# EAGLE design led_watch (EAGLE 5.12)

## Sheet 1 of 2
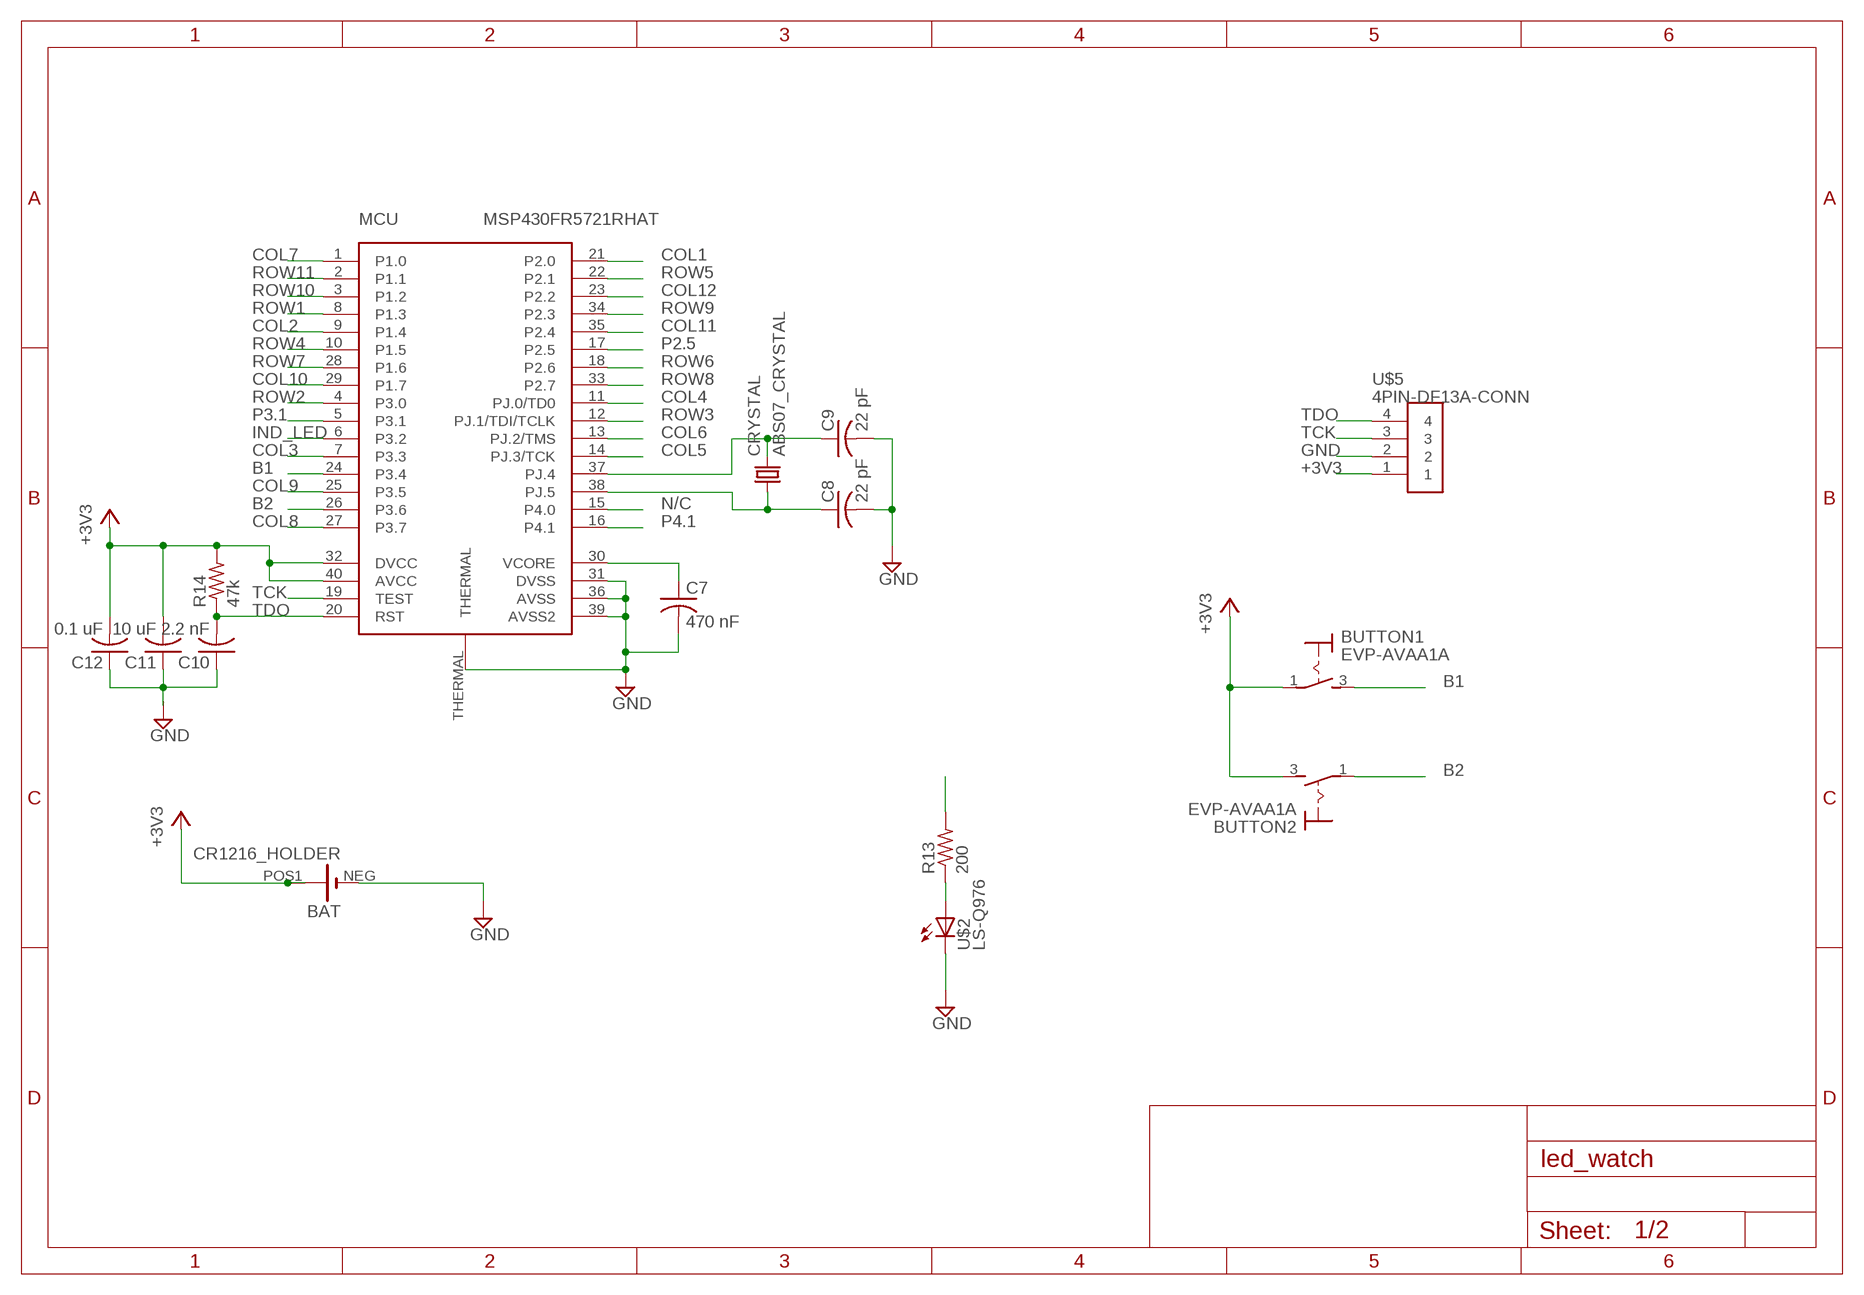
[diagram p0: schematic, sheet 1]

### Parts
BAT  CR1216_HOLDER  [CR1216]
BUTTON1  EVP-AVAA1A  [TACTILE-EVQP40B3M]
BUTTON2  EVP-AVAA1A  [TACTILE-EVQP40B3M]
C7  470 nF  C-USC0402  [C0402]
C8  22 pF  C-USC0402  [C0402]
C9  22 pF  C-USC0402  [C0402]
C10  2.2 nF  C-USC0402  [C0402]
C11  10 uF  C-USC0402  [C0402]
C12  0.1 uF  C-USC0402  [C0402]
CRYSTAL  ABS07_CRYSTAL  [ABS07]
MCU  MSP430FR5721RHAT  [40PIN-VQFN]
R13  200  R-US_R0201  [R0201]
R14  47k  R-US_R0402  [R0402]
U$2  LS-Q976  [SMD_LED_0402]
U$5  4PIN-DF13A-CONN  [4-PADS]

### Nets
+3V3: BAT.POS1(+) BAT.POS2(+) BUTTON1.1(P) BUTTON2.3(S) C11.2 C12.2 MCU.32(DVCC) MCU.40(AVCC) R14.2 U$5.1
B1: BUTTON1.3(S) MCU.24(P3.4)
B2: BUTTON2.1(P) MCU.26(P3.6)
COL1: MCU.21(P2.0) ; also sheet 2
COL2: MCU.9(P1.4) ; also sheet 2
COL3: MCU.7(P3.3) ; also sheet 2
COL4: MCU.11(PJ.0/TD0) ; also sheet 2
COL5: MCU.14(PJ.3/TCK) ; also sheet 2
COL6: MCU.13(PJ.2/TMS) ; also sheet 2
COL7: MCU.1(P1.0) ; also sheet 2
COL8: MCU.27(P3.7) ; also sheet 2
COL9: MCU.25(P3.5) ; also sheet 2
COL10: MCU.29(P1.7) ; also sheet 2
COL11: MCU.35(P2.4) ; also sheet 2
COL12: MCU.23(P2.2) ; also sheet 2
GND: BAT.NEG(-) C7.2 C8.2 C9.2 MCU.31(DVSS) MCU.36(AVSS) MCU.39(AVSS2) MCU.THERMAL U$2.2C(C) U$5.2
IND_LED: MCU.6(P3.2) R13.2
N$1: C9.1 CRYSTAL.2 MCU.37(PJ.4)
N$2: C8.1 CRYSTAL.1 MCU.38(PJ.5)
N$3: R13.1 U$2.1A(A)
N$4: C7.1 MCU.30(VCORE)
N$6: C10.1 C11.1 C12.1
N/C: MCU.15(P4.0)
P2.5: MCU.17(P2.5)
P3.1: MCU.5(P3.1)
P4.1: MCU.16(P4.1)
ROW1: MCU.8(P1.3) ; also sheet 2
ROW2: MCU.4(P3.0) ; also sheet 2
ROW3: MCU.12(PJ.1/TDI/TCLK) ; also sheet 2
ROW4: MCU.10(P1.5) ; also sheet 2
ROW5: MCU.22(P2.1) ; also sheet 2
ROW6: MCU.18(P2.6) ; also sheet 2
ROW7: MCU.28(P1.6) ; also sheet 2
ROW8: MCU.33(P2.7) ; also sheet 2
ROW9: MCU.34(P2.3) ; also sheet 2
ROW10: MCU.3(P1.2) ; also sheet 2
ROW11: MCU.2(P1.1) ; also sheet 2
TCK: MCU.19(TEST) U$5.3
TDO: C10.2 MCU.20(RST) R14.1 U$5.4

## Sheet 2 of 2
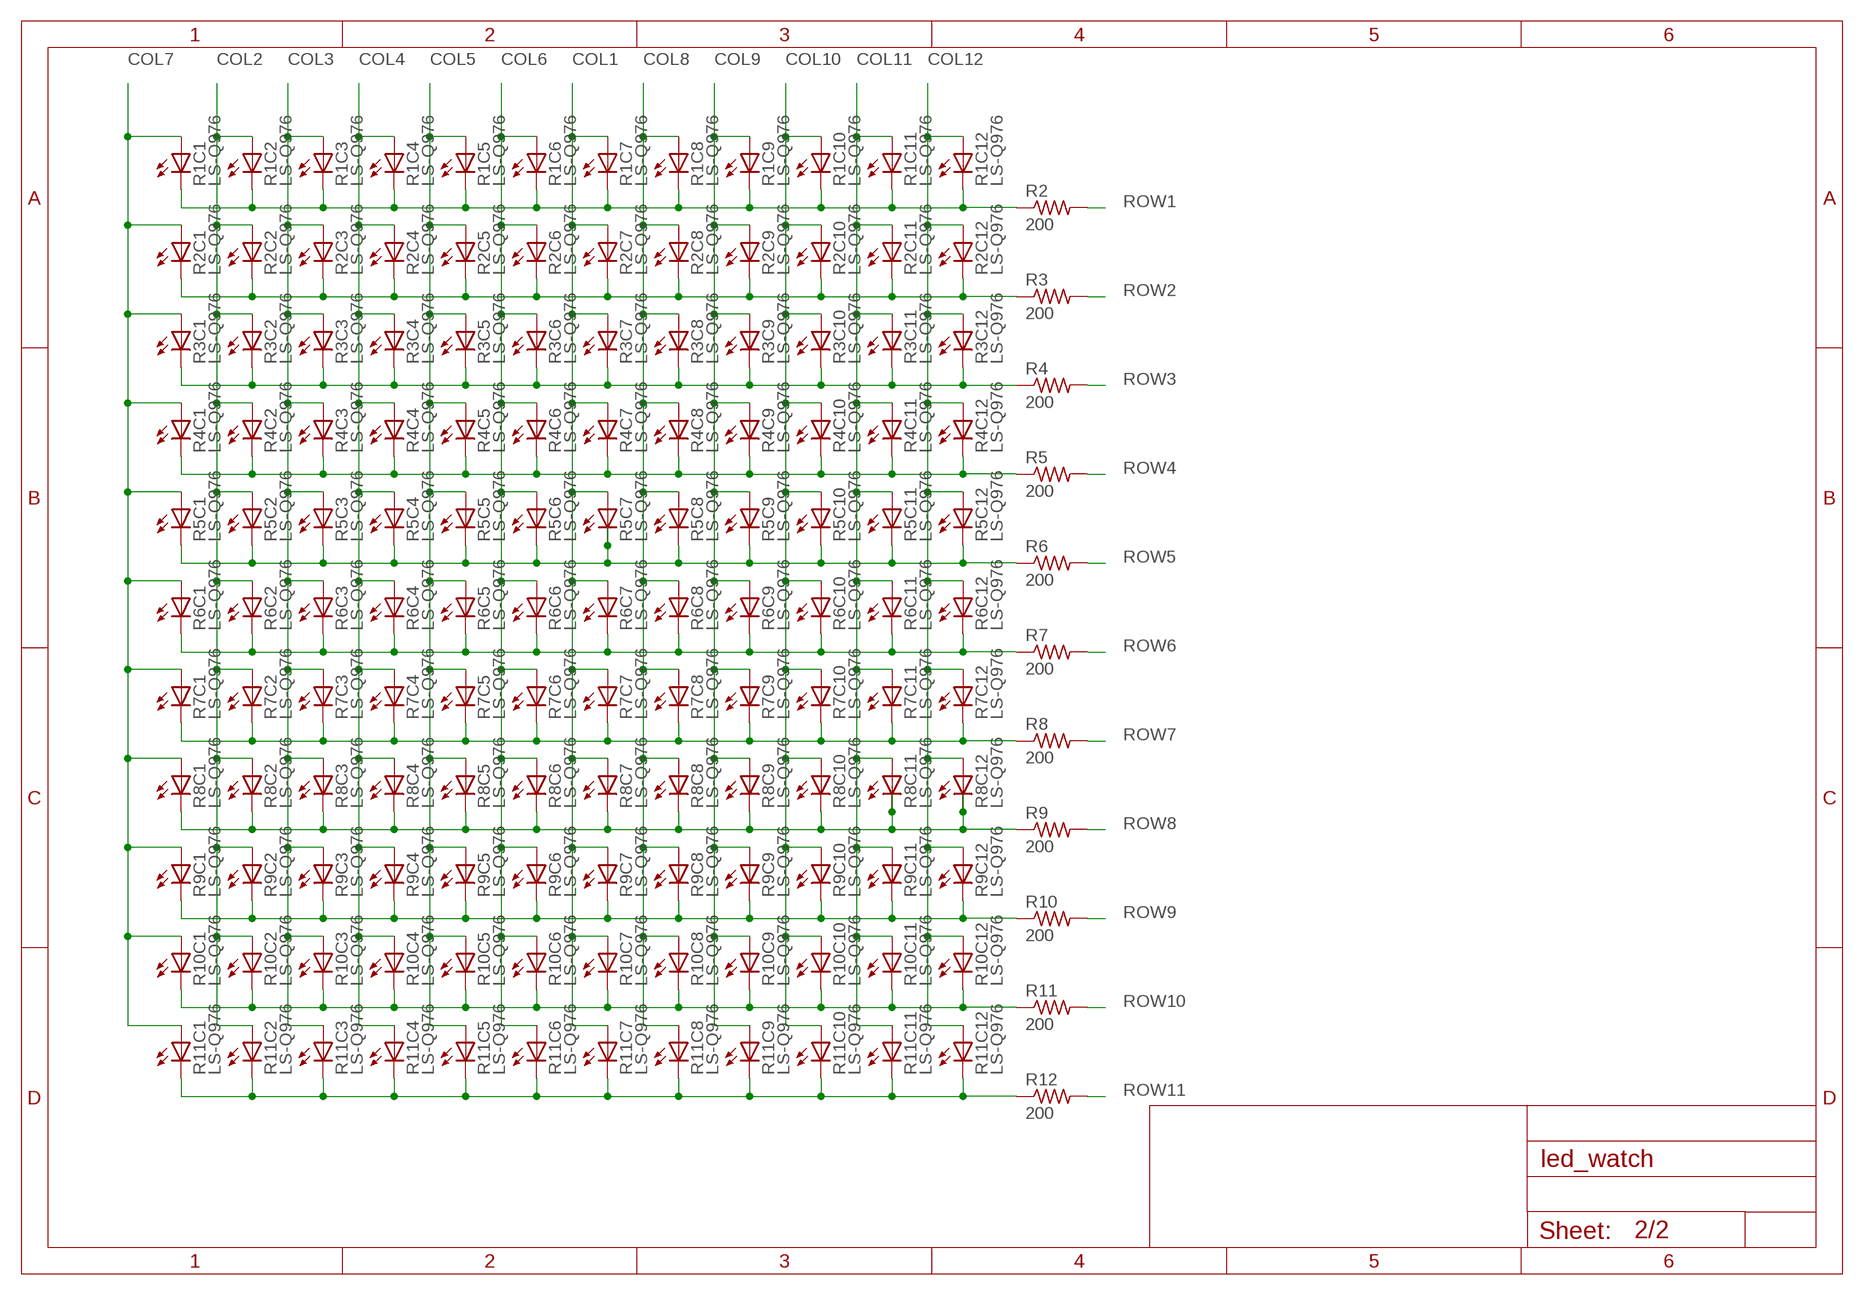
[diagram p1: schematic, sheet 2]

### Parts
R1C1  LS-Q976  [SMD_LED_0402]
R1C2  LS-Q976  [SMD_LED_0402]
R1C3  LS-Q976  [SMD_LED_0402]
R1C4  LS-Q976  [SMD_LED_0402]
R1C5  LS-Q976  [SMD_LED_0402]
R1C6  LS-Q976  [SMD_LED_0402]
R1C7  LS-Q976  [SMD_LED_0402]
R1C8  LS-Q976  [SMD_LED_0402]
R1C9  LS-Q976  [SMD_LED_0402]
R1C10  LS-Q976  [SMD_LED_0402]
R1C11  LS-Q976  [SMD_LED_0402]
R1C12  LS-Q976  [SMD_LED_0402]
R2  200  R-US_R0201  [R0201]
R2C1  LS-Q976  [SMD_LED_0402]
R2C2  LS-Q976  [SMD_LED_0402]
R2C3  LS-Q976  [SMD_LED_0402]
R2C4  LS-Q976  [SMD_LED_0402]
R2C5  LS-Q976  [SMD_LED_0402]
R2C6  LS-Q976  [SMD_LED_0402]
R2C7  LS-Q976  [SMD_LED_0402]
R2C8  LS-Q976  [SMD_LED_0402]
R2C9  LS-Q976  [SMD_LED_0402]
R2C10  LS-Q976  [SMD_LED_0402]
R2C11  LS-Q976  [SMD_LED_0402]
R2C12  LS-Q976  [SMD_LED_0402]
R3  200  R-US_R0201  [R0201]
R3C1  LS-Q976  [SMD_LED_0402]
R3C2  LS-Q976  [SMD_LED_0402]
R3C3  LS-Q976  [SMD_LED_0402]
R3C4  LS-Q976  [SMD_LED_0402]
R3C5  LS-Q976  [SMD_LED_0402]
R3C6  LS-Q976  [SMD_LED_0402]
R3C7  LS-Q976  [SMD_LED_0402]
R3C8  LS-Q976  [SMD_LED_0402]
R3C9  LS-Q976  [SMD_LED_0402]
R3C10  LS-Q976  [SMD_LED_0402]
R3C11  LS-Q976  [SMD_LED_0402]
R3C12  LS-Q976  [SMD_LED_0402]
R4  200  R-US_R0201  [R0201]
R4C1  LS-Q976  [SMD_LED_0402]
R4C2  LS-Q976  [SMD_LED_0402]
R4C3  LS-Q976  [SMD_LED_0402]
R4C4  LS-Q976  [SMD_LED_0402]
R4C5  LS-Q976  [SMD_LED_0402]
R4C6  LS-Q976  [SMD_LED_0402]
R4C7  LS-Q976  [SMD_LED_0402]
R4C8  LS-Q976  [SMD_LED_0402]
R4C9  LS-Q976  [SMD_LED_0402]
R4C10  LS-Q976  [SMD_LED_0402]
R4C11  LS-Q976  [SMD_LED_0402]
R4C12  LS-Q976  [SMD_LED_0402]
R5  200  R-US_R0201  [R0201]
R5C1  LS-Q976  [SMD_LED_0402]
R5C2  LS-Q976  [SMD_LED_0402]
R5C3  LS-Q976  [SMD_LED_0402]
R5C4  LS-Q976  [SMD_LED_0402]
R5C5  LS-Q976  [SMD_LED_0402]
R5C6  LS-Q976  [SMD_LED_0402]
R5C7  LS-Q976  [SMD_LED_0402]
R5C8  LS-Q976  [SMD_LED_0402]
R5C9  LS-Q976  [SMD_LED_0402]
R5C10  LS-Q976  [SMD_LED_0402]
R5C11  LS-Q976  [SMD_LED_0402]
R5C12  LS-Q976  [SMD_LED_0402]
R6  200  R-US_R0201  [R0201]
R6C1  LS-Q976  [SMD_LED_0402]
R6C2  LS-Q976  [SMD_LED_0402]
R6C3  LS-Q976  [SMD_LED_0402]
R6C4  LS-Q976  [SMD_LED_0402]
R6C5  LS-Q976  [SMD_LED_0402]
R6C6  LS-Q976  [SMD_LED_0402]
R6C7  LS-Q976  [SMD_LED_0402]
R6C8  LS-Q976  [SMD_LED_0402]
R6C9  LS-Q976  [SMD_LED_0402]
R6C10  LS-Q976  [SMD_LED_0402]
R6C11  LS-Q976  [SMD_LED_0402]
R6C12  LS-Q976  [SMD_LED_0402]
R7  200  R-US_R0201  [R0201]
R7C1  LS-Q976  [SMD_LED_0402]
R7C2  LS-Q976  [SMD_LED_0402]
R7C3  LS-Q976  [SMD_LED_0402]
R7C4  LS-Q976  [SMD_LED_0402]
R7C5  LS-Q976  [SMD_LED_0402]
R7C6  LS-Q976  [SMD_LED_0402]
R7C7  LS-Q976  [SMD_LED_0402]
R7C8  LS-Q976  [SMD_LED_0402]
R7C9  LS-Q976  [SMD_LED_0402]
R7C10  LS-Q976  [SMD_LED_0402]
R7C11  LS-Q976  [SMD_LED_0402]
R7C12  LS-Q976  [SMD_LED_0402]
R8  200  R-US_R0201  [R0201]
R8C1  LS-Q976  [SMD_LED_0402]
R8C2  LS-Q976  [SMD_LED_0402]
R8C3  LS-Q976  [SMD_LED_0402]
R8C4  LS-Q976  [SMD_LED_0402]
R8C5  LS-Q976  [SMD_LED_0402]
R8C6  LS-Q976  [SMD_LED_0402]
R8C7  LS-Q976  [SMD_LED_0402]
R8C8  LS-Q976  [SMD_LED_0402]
R8C9  LS-Q976  [SMD_LED_0402]
R8C10  LS-Q976  [SMD_LED_0402]
R8C11  LS-Q976  [SMD_LED_0402]
R8C12  LS-Q976  [SMD_LED_0402]
R9  200  R-US_R0201  [R0201]
R9C1  LS-Q976  [SMD_LED_0402]
R9C2  LS-Q976  [SMD_LED_0402]
R9C3  LS-Q976  [SMD_LED_0402]
R9C4  LS-Q976  [SMD_LED_0402]
R9C5  LS-Q976  [SMD_LED_0402]
R9C6  LS-Q976  [SMD_LED_0402]
R9C7  LS-Q976  [SMD_LED_0402]
R9C8  LS-Q976  [SMD_LED_0402]
R9C9  LS-Q976  [SMD_LED_0402]
R9C10  LS-Q976  [SMD_LED_0402]
R9C11  LS-Q976  [SMD_LED_0402]
R9C12  LS-Q976  [SMD_LED_0402]
R10  200  R-US_R0201  [R0201]
R10C1  LS-Q976  [SMD_LED_0402]
R10C2  LS-Q976  [SMD_LED_0402]
R10C3  LS-Q976  [SMD_LED_0402]
R10C4  LS-Q976  [SMD_LED_0402]
R10C5  LS-Q976  [SMD_LED_0402]
R10C6  LS-Q976  [SMD_LED_0402]
R10C7  LS-Q976  [SMD_LED_0402]
R10C8  LS-Q976  [SMD_LED_0402]
R10C9  LS-Q976  [SMD_LED_0402]
R10C10  LS-Q976  [SMD_LED_0402]
R10C11  LS-Q976  [SMD_LED_0402]
R10C12  LS-Q976  [SMD_LED_0402]
R11  200  R-US_R0201  [R0201]
R11C1  LS-Q976  [SMD_LED_0402]
R11C2  LS-Q976  [SMD_LED_0402]
R11C3  LS-Q976  [SMD_LED_0402]
R11C4  LS-Q976  [SMD_LED_0402]
R11C5  LS-Q976  [SMD_LED_0402]
R11C6  LS-Q976  [SMD_LED_0402]
R11C7  LS-Q976  [SMD_LED_0402]
R11C8  LS-Q976  [SMD_LED_0402]
R11C9  LS-Q976  [SMD_LED_0402]
R11C10  LS-Q976  [SMD_LED_0402]
R11C11  LS-Q976  [SMD_LED_0402]
R11C12  LS-Q976  [SMD_LED_0402]
R12  200  R-US_R0201  [R0201]

### Nets
COL1: R1C7.1A(A) R2C7.1A(A) R3C7.1A(A) R4C7.1A(A) R5C7.1A(A) R6C7.1A(A) R7C7.1A(A) R8C7.1A(A) R9C7.1A(A) R10C7.1A(A) R11C7.1A(A) ; also sheet 1
COL2: R1C2.1A(A) R2C2.1A(A) R3C2.1A(A) R4C2.1A(A) R5C2.1A(A) R6C2.1A(A) R7C2.1A(A) R8C2.1A(A) R9C2.1A(A) R10C2.1A(A) R11C2.1A(A) ; also sheet 1
COL3: R1C3.1A(A) R2C3.1A(A) R3C3.1A(A) R4C3.1A(A) R5C3.1A(A) R6C3.1A(A) R7C3.1A(A) R8C3.1A(A) R9C3.1A(A) R10C3.1A(A) R11C3.1A(A) ; also sheet 1
COL4: R1C4.1A(A) R2C4.1A(A) R3C4.1A(A) R4C4.1A(A) R5C4.1A(A) R6C4.1A(A) R7C4.1A(A) R8C4.1A(A) R9C4.1A(A) R10C4.1A(A) R11C4.1A(A) ; also sheet 1
COL5: R1C5.1A(A) R2C5.1A(A) R3C5.1A(A) R4C5.1A(A) R5C5.1A(A) R6C5.1A(A) R7C5.1A(A) R8C5.1A(A) R9C5.1A(A) R10C5.1A(A) R11C5.1A(A) ; also sheet 1
COL6: R1C6.1A(A) R2C6.1A(A) R3C6.1A(A) R4C6.1A(A) R5C6.1A(A) R6C6.1A(A) R7C6.1A(A) R8C6.1A(A) R9C6.1A(A) R10C6.1A(A) R11C6.1A(A) ; also sheet 1
COL7: R1C1.1A(A) R2C1.1A(A) R3C1.1A(A) R4C1.1A(A) R5C1.1A(A) R6C1.1A(A) R7C1.1A(A) R8C1.1A(A) R9C1.1A(A) R10C1.1A(A) R11C1.1A(A) ; also sheet 1
COL8: R1C8.1A(A) R2C8.1A(A) R3C8.1A(A) R4C8.1A(A) R5C8.1A(A) R6C8.1A(A) R7C8.1A(A) R8C8.1A(A) R9C8.1A(A) R10C8.1A(A) R11C8.1A(A) ; also sheet 1
COL9: R1C9.1A(A) R2C9.1A(A) R3C9.1A(A) R4C9.1A(A) R5C9.1A(A) R6C9.1A(A) R7C9.1A(A) R8C9.1A(A) R9C9.1A(A) R10C9.1A(A) R11C9.1A(A) ; also sheet 1
COL10: R1C10.1A(A) R2C10.1A(A) R3C10.1A(A) R4C10.1A(A) R5C10.1A(A) R6C10.1A(A) R7C10.1A(A) R8C10.1A(A) R9C10.1A(A) R10C10.1A(A) R11C10.1A(A) ; also sheet 1
COL11: R1C11.1A(A) R2C11.1A(A) R3C11.1A(A) R4C11.1A(A) R5C11.1A(A) R6C11.1A(A) R7C11.1A(A) R8C11.1A(A) R9C11.1A(A) R10C11.1A(A) R11C11.1A(A) ; also sheet 1
COL12: R1C12.1A(A) R2C12.1A(A) R3C12.1A(A) R4C12.1A(A) R5C12.1A(A) R6C12.1A(A) R7C12.1A(A) R8C12.1A(A) R9C12.1A(A) R10C12.1A(A) R11C12.1A(A) ; also sheet 1
R2: R1C1.2C(C) R1C2.2C(C) R1C3.2C(C) R1C4.2C(C) R1C5.2C(C) R1C6.2C(C) R1C7.2C(C) R1C8.2C(C) R1C9.2C(C) R1C10.2C(C) R1C11.2C(C) R1C12.2C(C) R2.1
R3: R2C1.2C(C) R2C2.2C(C) R2C3.2C(C) R2C4.2C(C) R2C5.2C(C) R2C6.2C(C) R2C7.2C(C) R2C8.2C(C) R2C9.2C(C) R2C10.2C(C) R2C11.2C(C) R2C12.2C(C) R3.1
R4: R3C1.2C(C) R3C2.2C(C) R3C3.2C(C) R3C4.2C(C) R3C5.2C(C) R3C6.2C(C) R3C7.2C(C) R3C8.2C(C) R3C9.2C(C) R3C10.2C(C) R3C11.2C(C) R3C12.2C(C) R4.1
R5: R4C1.2C(C) R4C2.2C(C) R4C3.2C(C) R4C4.2C(C) R4C5.2C(C) R4C6.2C(C) R4C7.2C(C) R4C8.2C(C) R4C9.2C(C) R4C10.2C(C) R4C11.2C(C) R4C12.2C(C) R5.1
R6: R5C1.2C(C) R5C2.2C(C) R5C3.2C(C) R5C4.2C(C) R5C5.2C(C) R5C6.2C(C) R5C7.2C(C) R5C8.2C(C) R5C9.2C(C) R5C10.2C(C) R5C11.2C(C) R5C12.2C(C) R6.1
R7: R6C1.2C(C) R6C2.2C(C) R6C3.2C(C) R6C4.2C(C) R6C5.2C(C) R6C6.2C(C) R6C7.2C(C) R6C8.2C(C) R6C9.2C(C) R6C10.2C(C) R6C11.2C(C) R6C12.2C(C) R7.1
R8: R7C1.2C(C) R7C2.2C(C) R7C3.2C(C) R7C4.2C(C) R7C5.2C(C) R7C6.2C(C) R7C7.2C(C) R7C8.2C(C) R7C9.2C(C) R7C10.2C(C) R7C11.2C(C) R7C12.2C(C) R8.1
R9: R8C1.2C(C) R8C2.2C(C) R8C3.2C(C) R8C4.2C(C) R8C5.2C(C) R8C6.2C(C) R8C7.2C(C) R8C8.2C(C) R8C9.2C(C) R8C10.2C(C) R8C11.2C(C) R8C12.2C(C) R9.1
R10: R9C1.2C(C) R9C2.2C(C) R9C3.2C(C) R9C4.2C(C) R9C5.2C(C) R9C6.2C(C) R9C7.2C(C) R9C8.2C(C) R9C9.2C(C) R9C10.2C(C) R9C11.2C(C) R9C12.2C(C) R10.1
R11: R10C1.2C(C) R10C2.2C(C) R10C3.2C(C) R10C4.2C(C) R10C5.2C(C) R10C6.2C(C) R10C7.2C(C) R10C8.2C(C) R10C9.2C(C) R10C10.2C(C) R10C11.2C(C) R10C12.2C(C) R11.1
R12: R11C1.2C(C) R11C2.2C(C) R11C3.2C(C) R11C4.2C(C) R11C5.2C(C) R11C6.2C(C) R11C7.2C(C) R11C8.2C(C) R11C9.2C(C) R11C10.2C(C) R11C11.2C(C) R11C12.2C(C) R12.1
ROW1: R2.2 ; also sheet 1
ROW2: R3.2 ; also sheet 1
ROW3: R4.2 ; also sheet 1
ROW4: R5.2 ; also sheet 1
ROW5: R6.2 ; also sheet 1
ROW6: R7.2 ; also sheet 1
ROW7: R8.2 ; also sheet 1
ROW8: R9.2 ; also sheet 1
ROW9: R10.2 ; also sheet 1
ROW10: R11.2 ; also sheet 1
ROW11: R12.2 ; also sheet 1

## Library data of the parts
BAT = personal:CR1216_HOLDER
BUTTON1 BUTTON2 = personal:EVP-AVAA1A
C7-C12 = rcl:C-US: CAPACITOR, American symbol
CRYSTAL = personal:ABS07_CRYSTAL
MCU = personal:MSP430FR5721RHAT
R1C1-R1C12 R2C1-R2C12 R3C1-R3C12 R4C1-R4C12 R5C1-R5C12 R6C1-R6C12 R7C1-R7C12 R8C1-R8C12 R9C1-R9C12 R10C1-R10C12 R11C1-R11C12 U$2 = personal:LS-Q976
R2-R14 = rcl:R-US_: RESISTOR, American symbol
U$5 = personal:4PIN-DF13A-CONN

## Net classes
0 default: drill 0.33 mm

## Board
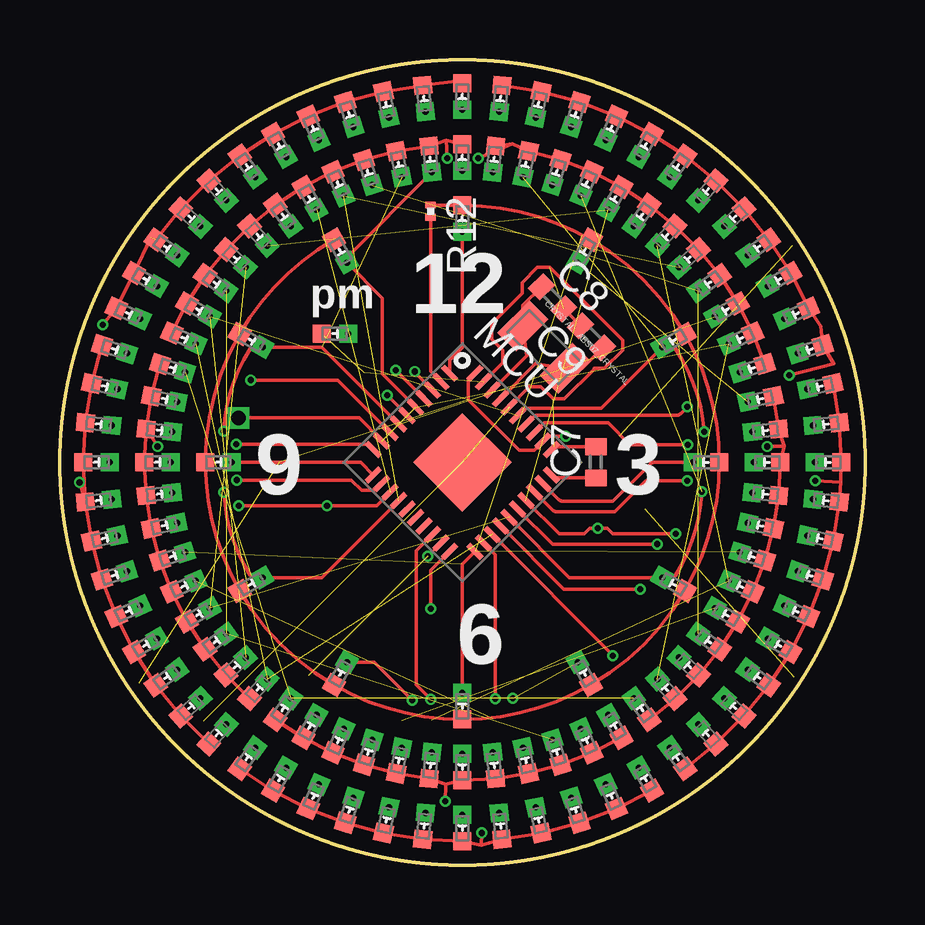
[diagram p2: board, top side]
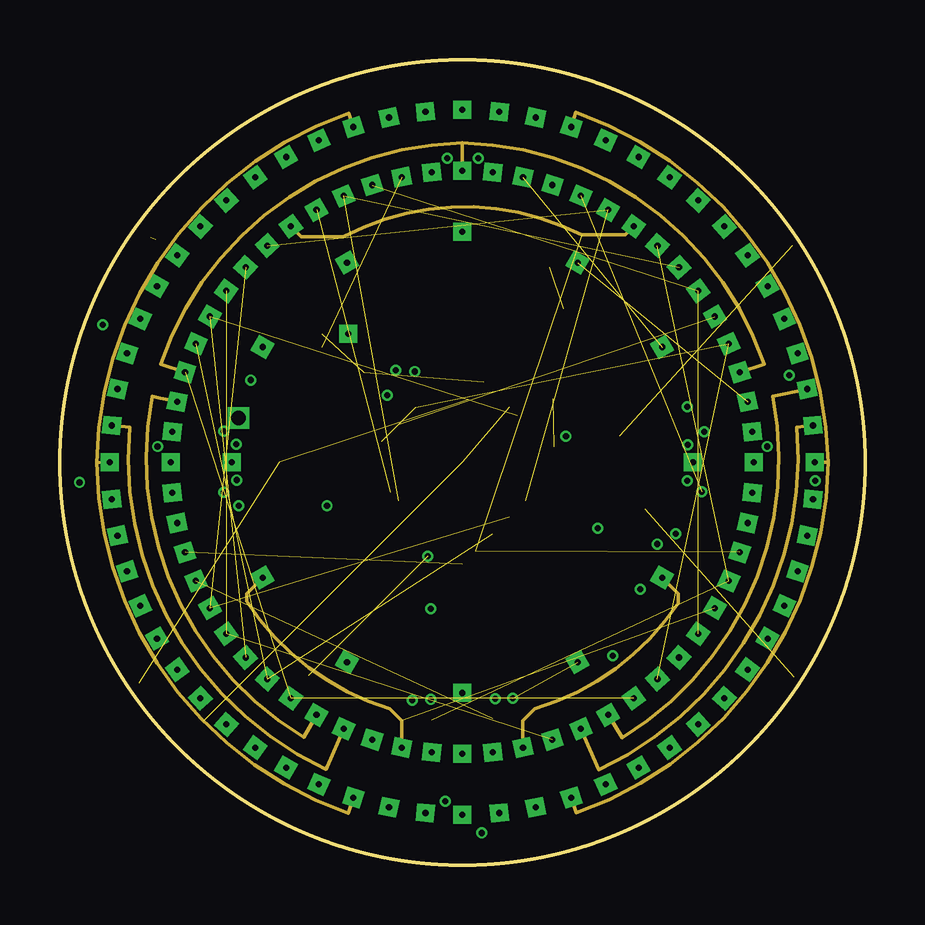
[diagram p3: board, inner layer Route3]
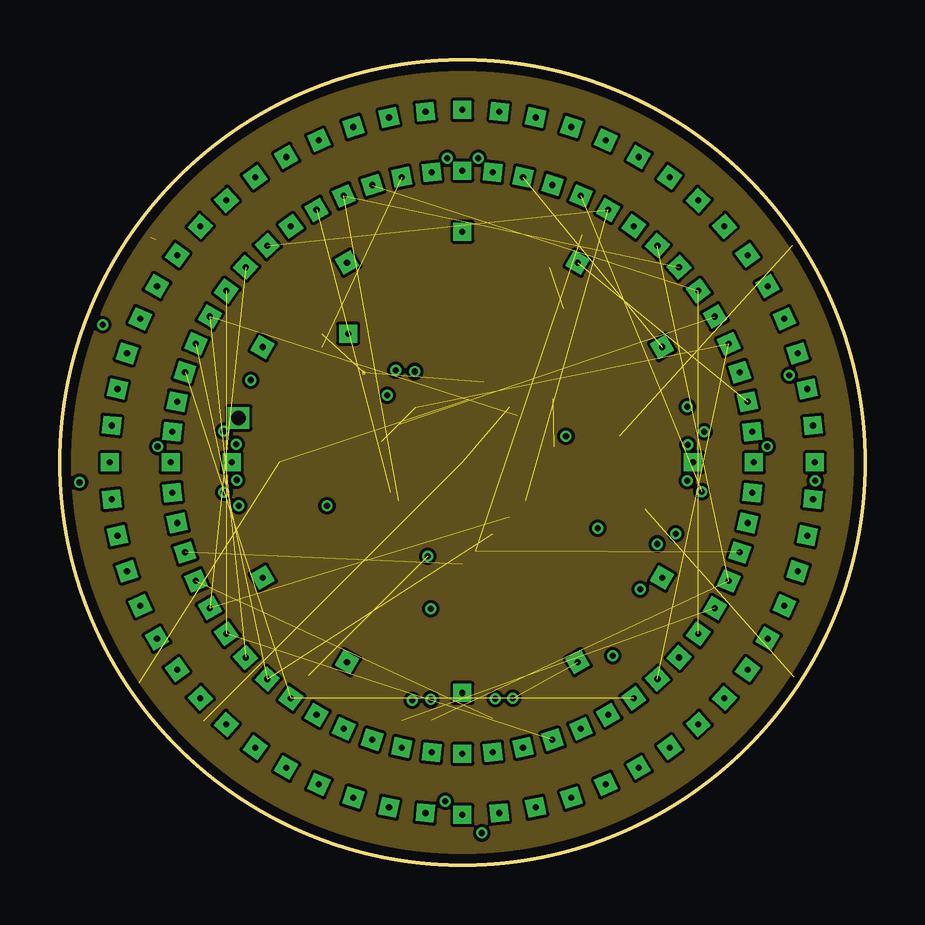
[diagram p4: board, inner layer Route15]
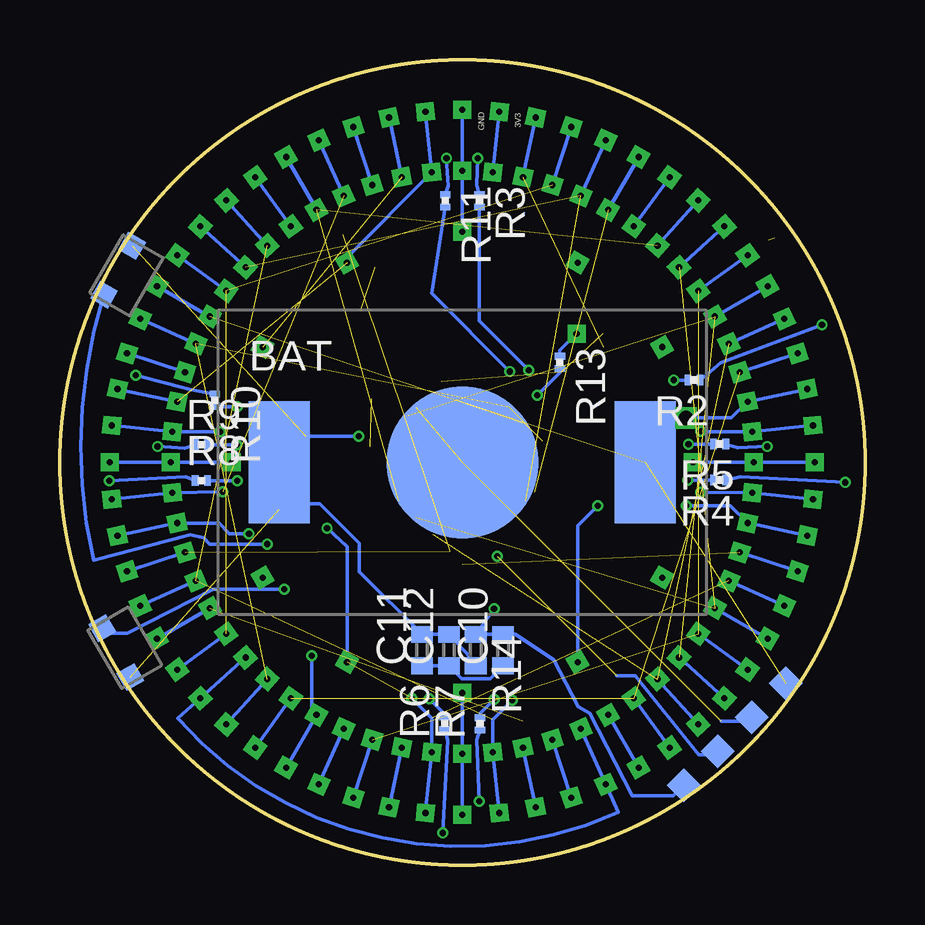
[diagram p5: board, bottom side, seen from below]

Size 33.53 x 33.53 mm. Coordinates in mm from the lower left corner, seen from the top.
Outline: circle at 16.76,16.76 radius 16.76
Copper layers (1+3*15+16): Top 0.0356mm / dielectric 0.1702mm / Route3 0.035mm / dielectric 0.2mm / Route15 0.0178mm / dielectric 0.1981mm / Bottom 0.0356mm
Design rules "OSH Park 4-layer 5-5 *": minimum track width 5mil, minimum drill 10mil, track to track 5mil, track to pad 5mil, pad to pad 5mil, via to via 5mil, smd to smd 5mil, copper to edge 15mil, drill to drill 8mil, minimum pad ring 4mil, minimum via ring 4mil, stop-mask expansion 4mil, vias tented up to drill 20mil, thermal gap 10mil

### Footprints (pad centres in the part's own frame; a part is rotated, then mirrored left to right if it is on the bottom)
CR1216 = smd 6.35 x 6.35: NEG 0,0 | smd 2.54 x 5.08: POS1 -7.62,0; POS2 7.62,0
TACTILE-EVQP40B3M = smd 0.85 x 0.85: 1 -1.175,1.986; 3 1.175,1.986
C0402 = smd 0.7 x 0.9: 1 -0.65,0; 2 0.65,0
ABS07 = smd 1.092 x 1.905: 1 -1.245,0; 2 1.245,0
40PIN-VQFN = smd 0.8 x 0.23: 1 -3,2.25; 2 -3,1.75; 3 -3,1.25; 4 -3,0.75; 5 -3,0.25; 6 -3,-0.25; 7 -3,-0.75; 8 -3,-1.25; 9 -3,-1.75; 10 -3,-2.25; 21 3,-2.25; 22 3,-1.75; 23 3,-1.25; 24 3,-0.75; 25 3,-0.25; 26 3,0.25; 27 3,0.75; 28 3,1.25; 29 3,1.75; 30 3,2.25 | smd 0.23 x 0.8: 11 -2.25,-3; 12 -1.75,-3; 13 -1.25,-3; 14 -0.75,-3; 15 -0.25,-3; 16 0.25,-3; 17 0.75,-3; 18 1.25,-3; 19 1.75,-3; 20 2.25,-3; 31 2.25,3; 32 1.75,3; 33 1.25,3; 34 0.75,3; 35 0.25,3; 36 -0.25,3; 37 -0.75,3; 38 -1.25,3; 39 -1.75,3; 40 -2.25,3 | smd 2.9 x 2.9: THERMAL 0,0
SMD_LED_0402 = drill 0.254 pad 0.75 square: 1A 0.55,0 | smd 0.75 x 0.75: 2C -0.55,0
R0201 = smd 0.28 x 0.43: 1 -0.255,0; 2 0.255,0
R0402 = smd 0.7 x 0.9: 1 -0.65,0; 2 0.65,0
4-PADS = smd 1 x 1: 1 3,0; 2 1,0; 3 -1,0; 4 -3,0

### Placement (x,y rotation side)
BAT  16.76,16.76 0 bottom
BUTTON1  29.46,9.83 120 bottom
BUTTON2  29.39,23.77 60 bottom
C7  22.33,16.76 90 top
C8  20.52,23.62 315 top
C9  22.15,22 135 top
C10  15.06,8.94 90 bottom
C11  18.44,8.94 90 bottom
C12  17.32,8.94 90 bottom
CRYSTAL  20.17,21.56 315 top
MCU  16.76,16.76 315 top
R1C1  16.76,32 270 top
R1C2  15.17,31.92 276 top
R1C3  13.6,31.67 282 top
R1C4  12.05,31.26 288 top
R1C5  10.57,30.69 294 top
R1C6  9.14,29.96 300 top
R1C7  7.81,29.09 306 top
R1C8  6.57,28.09 312 top
R1C9  5.44,26.96 318 top
R1C10  4.43,25.72 324 top
R1C11  3.57,24.38 330 top
R1C12  2.84,22.96 336 top
R2  7.11,20.19 180 bottom
R2C1  16.76,29.46 270 top
R2C2  15.44,29.39 276 top
R2C3  14.12,29.19 282 top
R2C4  12.84,28.84 288 top
R2C5  11.6,28.37 294 top
R2C6  10.41,27.76 300 top
R2C7  9.3,27.04 306 top
R2C8  8.27,26.2 312 top
R2C9  7.33,25.26 318 top
R2C10  6.49,24.23 324 top
R2C11  5.77,23.11 330 top
R2C12  5.16,21.93 336 top
R3  16.05,27.66 270 bottom
R3C1  2.27,21.47 342 top
R3C2  1.86,19.93 348 top
R3C3  1.61,18.36 354 top
R3C4  1.52,16.76 0 top
R3C5  1.61,15.17 6 top
R3C6  1.86,13.6 12 top
R3C7  2.27,12.05 18 top
R3C8  2.84,10.57 24 top
R3C9  3.57,9.14 30 top
R3C10  4.43,7.81 36 top
R3C11  5.44,6.57 42 top
R3C12  6.57,5.44 48 top
R4  6.05,16.03 180 bottom
R4C1  4.69,20.69 342 top
R4C2  4.34,19.4 348 top
R4C3  4.13,18.09 354 top
R4C4  4.06,16.76 0 top
R4C5  4.13,15.44 6 top
R4C6  4.34,14.12 12 top
R4C7  4.69,12.84 18 top
R4C8  5.16,11.6 24 top
R4C9  5.77,10.41 30 top
R4C10  6.49,9.3 36 top
R4C11  7.33,8.27 42 top
R4C12  8.27,7.33 48 top
R5  6.05,17.53 180 bottom
R5C1  7.81,4.43 54 top
R5C2  9.14,3.57 60 top
R5C3  10.57,2.84 66 top
R5C4  12.05,2.27 72 top
R5C5  13.6,1.86 78 top
R5C6  15.17,1.61 84 top
R5C7  16.76,1.52 90 top
R5C8  18.36,1.61 96 top
R5C9  19.93,1.86 102 top
R5C10  21.47,2.27 108 top
R5C11  22.96,2.84 114 top
R5C12  24.38,3.57 120 top
R6  17.5,5.89 90 bottom
R6C1  9.3,6.49 54 top
R6C2  10.41,5.77 60 top
R6C3  11.6,5.16 66 top
R6C4  12.84,4.69 72 top
R6C5  14.12,4.34 78 top
R6C6  15.44,4.13 84 top
R6C7  16.76,4.06 90 top
R6C8  18.09,4.13 96 top
R6C9  19.4,4.34 102 top
R6C10  20.69,4.69 108 top
R6C11  21.93,5.16 114 top
R6C12  23.11,5.77 120 top
R7  16.03,5.87 90 bottom
R7C1  25.72,4.43 126 top
R7C2  26.96,5.44 132 top
R7C3  28.09,6.57 138 top
R7C4  29.09,7.81 144 top
R7C5  29.96,9.14 150 top
R7C6  30.69,10.57 156 top
R7C7  31.26,12.05 162 top
R7C8  31.67,13.6 168 top
R7C9  31.92,15.17 174 top
R7C10  32,16.76 180 top
R7C11  31.92,18.36 186 top
R7C12  31.67,19.93 192 top
R8  27.64,16 0 bottom
R8C1  24.23,6.49 126 top
R8C2  25.26,7.33 132 top
R8C3  26.2,8.27 138 top
R8C4  27.04,9.3 144 top
R8C5  27.76,10.41 150 top
R8C6  28.37,11.6 156 top
R8C7  28.84,12.84 162 top
R8C8  29.19,14.12 168 top
R8C9  29.39,15.44 174 top
R8C10  29.46,16.76 180 top
R8C11  29.39,18.09 186 top
R8C12  29.19,19.4 192 top
R9  27.64,17.5 0 bottom
R9C1  31.26,21.47 198 top
R9C2  30.69,22.96 204 top
R9C3  29.96,24.38 210 top
R9C4  29.09,25.72 216 top
R9C5  28.09,26.96 222 top
R9C6  26.96,28.09 228 top
R9C7  25.72,29.09 234 top
R9C8  24.38,29.96 240 top
R9C9  22.96,30.69 246 top
R9C10  21.47,31.26 252 top
R9C11  19.93,31.67 258 top
R9C12  18.36,31.92 264 top
R10  27.08,19.35 270 bottom
R10C1  28.84,20.69 198 top
R10C2  28.37,21.93 204 top
R10C3  27.76,23.11 210 top
R10C4  27.04,24.23 216 top
R10C5  26.2,25.26 222 top
R10C6  25.26,26.2 228 top
R10C7  24.23,27.04 234 top
R10C8  23.11,27.76 240 top
R10C9  21.93,28.37 246 top
R10C10  20.69,28.84 252 top
R10C11  19.4,29.19 258 top
R10C12  18.09,29.39 264 top
R11  17.48,27.66 270 bottom
R11C1  16.76,26.92 270 top
R11C2  11.68,25.56 300 top
R11C3  7.97,21.84 330 top
R11C4  6.6,16.76 0 top
R11C5  7.97,11.68 30 top
R11C6  11.68,7.97 60 top
R11C7  16.76,6.6 90 top
R11C8  21.84,7.97 120 top
R11C9  25.56,11.68 150 top
R11C10  26.92,16.76 180 top
R11C11  25.56,21.84 210 top
R11C12  21.84,25.56 240 top
R12  15.44,27.23 270 top
R13  12.7,20.93 270 bottom
R14  16.21,8.94 270 bottom
U$2  11.46,22.12 0 top
U$5  5.41,5.44 45 bottom

### Tracks (layer width: path | path; a pad name or v marks a point on that pad's centre or on a via)
+3V3  (via drill 0.25)  (4 unrouted)
  Top 0.152: v21.08,17.86 20.33,17.86 MCU.32 19.76,17.27 19.13,17.27 17.02,19.38 17.02,20.2 MCU.40
  Bottom 0.152: v21.08,17.86 23.29,17.86 BAT.POS1 24.38,15.04 | 24.38,15.04 24.38,14.82 | R14.2 16.1,8.29 C12.2 C11.2 21.06,12.21 21.06,13.39 22.71,15.04 24.38,15.04
B1  (via drill 0.25)
  Top 0.152: MCU.24 20.99,11.48 v24.18,11.48
  Bottom 0.152: v24.18,11.48 27.15,11.48 30.73,9.65 31.57,9.65 arc90 BUTTON1.3
B2  (via drill 0.25)
  Top 0.152: MCU.26 20.52,13.36 v24.89,13.36
  Bottom 0.152: v24.89,13.36 27.28,13.36 27.53,13.61 28.09,13.74 32.13,12.67 arc30 BUTTON2.1
COL1  (3 unrouted)
  Top 0.152: R11C7.1A 16.76,12.52 MCU.21
  Route3 0.152: R10C7.1A 23.55,26.24 21.74,26.24 arc55 11.81,26.16 10.05,26.16 R2C7.1A
  Bottom 0.152: R4C7.1A R3C7.1A | R1C7.1A R2C7.1A | R10C7.1A R9C7.1A | R8C7.1A R7C7.1A | R5C7.1A R6C7.1A R11C7.1A
COL2  (via drill 0.6)  (3 unrouted)
  Top 0.152: 14.82,19.06 13.44,20.45 13.44,23.61 R11C2.1A 11.96,25.31 R2C2.1A | v7.44,18.62 12.47,18.62 12.75,18.34 MCU.9
  Route3 0.152: R6C2.1A 10.16,5.31 arc-70 3.84,19.51 arc1 R4C2.1A
  Bottom 0.152: R6C2.1A R5C2.1A | R3C2.1A R4C2.1A 5.55,18.62 v7.44,18.62 | R2C2.1A R1C2.1A | R8C2.1A R7C2.1A | R10C2.1A R9C2.1A
COL3  (via drill 0.25)  (2 unrouted)
  Top 0.152: v6.83,18.06 arc-31 7.92,21.49 R11C3.1A 10.9,21.57 MCU.7
  Route3 0.152: R6C3.1A 11.12,4.09 11.07,3.97 arc-70 2.9,18.22 R3C3.1A
  Bottom 0.152: R3C3.1A R4C3.1A 6.81,18.03 v6.83,18.06 | R10C3.1A R9C3.1A | R8C3.1A R7C3.1A 28.63,6.1 arc-73 10.26,2.18 R5C3.1A R6C3.1A | R1C3.1A R2C3.1A
COL4  (2 unrouted)
  Top 0.152: R11C4.1A 12.52,16.76 MCU.11
  Route3 0.152: 1.52,16.74 arc-70 12.04,31.32 R1C4.1A | 1.52,16.74 arc70 12.01,2.13 R5C4.1A | R3C4.1A 1.52,16.74
  Bottom 0.152: R3C4.1A R4C4.1A R11C4.1A | R1C4.1A R2C4.1A | R10C4.1A R9C4.1A | R7C4.1A R8C4.1A | R5C4.1A R6C4.1A
COL5  (via drill 0.25)  (3 unrouted)
  Top 0.152: v6.83,15.52 arc30 7.92,12.06 R11C5.1A 10.9,11.96 MCU.14
  Route3 0.152: R6C5.1A 14.24,6.01 13.74,6.5 arc-40 7.77,10.97 7.77,11.29 R11C5.1A
  Bottom 0.152: v6.83,15.51 v6.83,15.52 R4C5.1A R3C5.1A | R1C5.1A R2C5.1A | R10C5.1A R9C5.1A | R8C5.1A R7C5.1A | R6C5.1A R5C5.1A
COL6  (via drill 0.25)  (3 unrouted)
  Top 0.152: v7.44,14.96 v11.12,14.96 13.19,14.96 MCU.13 | R11C6.1A 13.1,8.44 v14.68,6.86
  Bottom 0.152: R3C6.1A R4C6.1A 5.6,14.96 v7.44,14.96 | R2C6.1A R1C6.1A | R10C6.1A R9C6.1A | R7C6.1A R8C6.1A | R5C6.1A R6C6.1A 15.49,6.04 v14.68,6.86 | R11C6.1A 11.96,14.13 v11.12,14.96
COL7  (2 unrouted)
  Top 0.152: R11C1.1A 16.76,21.54 16.23,21.01 MCU.1
  Route3 0.152: R4C1.1A 4.19,20.85 arc-70 16.76,30.07 | R2C1.1A 16.76,30.07 | R10C1.1A 29.34,20.85 arc70 16.76,30.07
  Bottom 0.152: R6C1.1A R5C1.1A | R4C1.1A R3C1.1A | R1C1.1A R2C1.1A R11C1.1A | R10C1.1A R9C1.1A | R8C1.1A R7C1.1A
COL8  (via drill 0.25)  (4 unrouted)
  Top 0.152: MCU.27 20.8,13.79 21.84,13.79 22.07,14.02 v22.4,14.02 22.81,14.02 23.04,13.79 v25.65,13.79
  Bottom 0.152: R4C8.1A R3C8.1A | R2C8.1A R1C8.1A | R10C8.1A R9C8.1A | R7C8.1A R8C8.1A 26.9,14.22 26.47,13.79 v25.65,13.79 | R5C8.1A R6C8.1A 18.03,6.1 v18.87,6.93 | R11C8.1A 21.57,13.24 v22.4,14.02
COL9  (via drill 0.25)  (3 unrouted)
  Top 0.152: v26.75,15.54 arc-30 25.63,12.04 R11C9.1A 21.22,11.96 MCU.25
  Route3 0.152: R6C9.1A 19.29,6.01 19.79,6.5 arc40 25.76,10.9 25.76,11.29 R11C9.1A
  Bottom 0.152: R4C9.1A R3C9.1A | R2C9.1A R1C9.1A | R10C9.1A R9C9.1A | R7C9.1A R8C9.1A v26.75,15.54 | R6C9.1A R5C9.1A
COL10  (2 unrouted)
  Top 0.152: MCU.29 20.79,15.21 arc45 20.97,15.14 23.04,15.14 24.59,16.69 arc-45 24.77,16.76 R11C10.1A
  Route3 0.152: 32,16.76 arc-70 21.51,2.16 R5C10.1A | 32,16.76 arc70 21.49,31.34 R9C10.1A | R7C10.1A 32,16.76
  Bottom 0.152: R4C10.1A R3C10.1A | R1C10.1A R2C10.1A | R9C10.1A R10C10.1A | R7C10.1A R8C10.1A R11C10.1A | R5C10.1A R6C10.1A
COL11  (via drill 0.25)  (3 unrouted)
  Top 0.152: MCU.35 19.38,19.02 22.54,19.02 R11C11.1A 25.63,21.51 arc-30 v26.85,18.03
  Route3 0.152: R6C11.1A 22.45,3.96 arc70 30.71,18.23 R7C11.1A
  Bottom 0.152: R4C11.1A R3C11.1A | R2C11.1A R1C11.1A | R10C11.1A R9C11.1A | R7C11.1A R8C11.1A v26.85,18.03 | R6C11.1A R5C11.1A
COL12  (via drill 0.25)  (3 unrouted)
  Top 0.152: MCU.23 v23.04,8.72 v23.04,8.71
  Route3 0.152: R7C12.1A 29.69,19.52 arc-70 23.42,5.28 R6C12.1A
  Bottom 0.152: R4C12.1A R3C12.1A | R1C12.1A R2C12.1A | R9C12.1A R10C12.1A 21.57,25.31 R11C12.1A | R7C12.1A R8C12.1A | R5C12.1A R6C12.1A 23.04,6.44 v23.04,8.71
GND  (7 unrouted)
  Top 0.152: C8.2 C9.2 | MCU.36 19.56,19.91 20.04,19.91 20.55,19.41 21.01,19.41 22.25,20.65 22.25,20.68 22.68,20.68 23.44,21.44 23.44,21.84 20.4,24.89 19.89,24.89 19.25,24.26 19.25,23.8 17.98,22.53 17.98,21.89 18.44,21.44 18.44,20.91 MCU.39 | C7.2 20.6,17.41 MCU.31
  Route15 0.152: 12.65,20.52 12.65,20.47
  Bottom 0.152: U$5.2 4.88,5.97 5.97,5.97
  pour Route15: -5.05,36.27 38.05,36.27 38.05,-4.5 -5.05,-4.5
IND_LED  (via drill 0.25)
  Top 0.152: MCU.6 14.47,18.73 v13.64,19.56
  Bottom 0.152: v13.64,19.56 12.7,20.5 R13.2
N$1
  Top 0.152: MCU.37 19.8,20.86 CRYSTAL.2 21.76,20.68 C9.1
N$2
  Top 0.152: MCU.38 19.44,21.21 CRYSTAL.1 19.29,23.31 C8.1
N$3
  Bottom 0.152: R13.1 12.7,21.43 U$2.1A
N$4
  Top 0.152: C7.1 20.6,16.11 MCU.30
N$6
  Bottom 0.152: C11.1 C12.1 16.78,7.75 15.61,7.75 C10.1
R2  (via drill 0.25)  (1 unrouted)
  Top 0.152: R1C2.2C 16.68,32.67 | 14.83,32.41 R1C3.2C R1C4.2C R1C5.2C R1C6.2C R1C7.2C R1C8.2C R1C9.2C R1C10.2C | 3.78,26.12 R1C11.2C R1C12.2C v1.78,22.5
  Top 0.254: 16.68,32.67 R1C1.2C | 14.83,32.41 R1C2.2C
  Bottom 0.152: R2.1 5.99,20.9 v1.78,22.5
R3  (via drill 0.25)
  Top 0.152: R2C12.2C R2C11.2C R2C10.2C R2C9.2C R2C8.2C R2C7.2C R2C6.2C R2C5.2C R2C4.2C R2C3.2C R2C2.2C 16.09,30.18 | 16.09,30.18 R2C1.2C | 16.09,30.18 v16.13,29.44
  Bottom 0.152: R3.1 16.15,28.32 v16.13,29.44
R4  (via drill 0.25)
  Top 0.152: R3C5.2C R3C4.2C R3C3.2C R3C2.2C R3C1.2C | R3C12.2C R3C11.2C R3C10.2C R3C9.2C R3C8.2C R3C7.2C R3C6.2C R3C5.2C | v0.81,15.93 R3C5.2C
  Bottom 0.152: v0.81,15.93 5.18,16.15 R4.1
R5  (via drill 0.25)
  Top 0.152: R4C12.2C R4C11.2C R4C10.2C R4C9.2C R4C8.2C R4C7.2C R4C6.2C R4C5.2C R4C4.2C R4C3.2C | R4C1.2C R4C2.2C R4C3.2C | R4C3.2C v4.06,17.42
  Bottom 0.152: v4.06,17.42 5.28,17.37 R5.1
R6  (via drill 0.25)
  Top 0.152: R5C1.2C R5C2.2C R5C3.2C R5C4.2C R5C5.2C R5C6.2C R5C7.2C 17.55,0.81 | 17.55,0.81 R5C8.2C R5C9.2C R5C10.2C R5C11.2C R5C12.2C | 17.55,0.81 v17.58,1.32
  Bottom 0.152: R6.1 17.37,5.18 v17.58,1.32
R7  (via drill 0.25)
  Top 0.152: R6C1.2C R6C2.2C R6C3.2C R6C4.2C R6C5.2C R6C6.2C 16.08,3.35 | 16.08,3.35 R6C7.2C R6C8.2C R6C9.2C R6C10.2C R6C11.2C R6C12.2C | 16.08,3.35 v16.05,2.64
  Bottom 0.152: R7.1 16.15,5.21 v16.05,2.64
R8  (via drill 0.25)
  Top 0.152: R7C1.2C R7C2.2C R7C3.2C R7C4.2C R7C5.2C R7C6.2C R7C7.2C R7C8.2C R7C9.2C 32.53,15.92 | 32.53,15.92 R7C10.2C R7C11.2C R7C12.2C | 32.53,15.92 v31.47,16
  Bottom 0.152: R8.1 28.3,16.15 v31.47,16
R9  (via drill 0.25)
  Top 0.152: 30.18,17.43 R8C10.2C R8C9.2C R8C8.2C R8C7.2C R8C6.2C R8C5.2C R8C4.2C R8C3.2C R8C2.2C R8C1.2C | 30.18,17.43 R8C11.2C R8C12.2C | 30.18,17.43 v29.46,17.42
  Bottom 0.152: R9.1 28.32,17.35 v29.46,17.42
R10  (via drill 0.25)
  Top 0.152: R9C12.2C R9C11.2C R9C10.2C R9C9.2C R9C8.2C R9C7.2C R9C6.2C R9C5.2C R9C4.2C R9C3.2C R9C2.2C 31.69,22.43 R9C1.2C 32.23,20.88 v30.38,20.4
  Bottom 0.152: R10.1 28.14,19.81 v30.38,20.4
R11  (via drill 0.25)
  Top 0.152: R10C1.2C R10C2.2C R10C3.2C R10C4.2C R10C5.2C R10C6.2C R10C7.2C R10C8.2C R10C9.2C R10C10.2C R10C11.2C 18.85,30.03 | 18.85,30.03 R10C12.2C | v17.42,29.44 18.85,30.03
  Bottom 0.152: v17.42,29.44 17.35,28.3 R11.1
R12
  Top 0.152: R11C2.2C arc30 R11C3.2C arc30 R11C4.2C arc30 R11C5.2C arc30 R11C6.2C arc30 R11C7.2C arc30 R11C8.2C arc30 R11C9.2C arc30 R11C10.2C arc30 R11C11.2C arc30 R11C12.2C arc30 R11C1.2C R12.1
ROW1  (via drill 0.25)
  Top 0.152: 13.79,18.03 MCU.8 11.57,20.19 v7.95,20.19
  Bottom 0.152: v7.95,20.19 R2.2
ROW2  (via drill 0.25)
  Top 0.152: v13.99,20.6 13.99,20.59 MCU.4
  Bottom 0.152: R3.2 16.05,22.66 v13.99,20.6
ROW3  (via drill 0.25)
  Top 0.152: v7.37,16.03 12.14,16.03 12.57,15.6 13.12,15.6 MCU.12
  Bottom 0.152: v7.37,16.03 R4.2
ROW4  (via drill 0.25)
  Top 0.152: v7.34,17.53 12.82,17.53 MCU.10
  Bottom 0.152: v7.34,17.53 R5.2
ROW5  (via drill 0.25)
  Top 0.152: MCU.22 18.14,12.92 v18.14,6.91
  Bottom 0.152: 17.4,6.15 R6.2 17.5,6.27 v18.14,6.91
ROW6  (via drill 0.25)
  Top 0.152: v15.44,6.88 14.83,7.49 14.83,13.08 15.51,13.76 MCU.18
  Bottom 0.152: R7.2 16.03,6.3 v15.44,6.88
ROW7  (via drill 0.25)
  Top 0.152: v26.14,16 24.52,16 arc45 24.34,15.93 23.11,14.71 20.69,14.71 arc-45 20.52,14.78 MCU.28
  Bottom 0.152: v26.14,16 R8.2
ROW8  (via drill 0.25)
  Top 0.152: v26.16,17.5 23.75,17.5 22.84,18.41 20.18,18.41 MCU.33
  Bottom 0.152: v26.16,17.5 R9.2
ROW9  (via drill 0.25)
  Top 0.152: MCU.34 19.71,18.64 arc-45 19.89,18.72 25.68,18.72 arc45 25.85,18.79 v26.14,19.07
  Bottom 0.152: v26.14,19.07 27.05,19.07 arc90 R10.2
ROW10  (via drill 0.25)
  Top 0.152: v14.78,20.55 14.78,20.51 MCU.3
  Bottom 0.152: R11.2 18.03,23.8 v14.78,20.55
ROW11
  Top 0.152: R12.2 15.44,20.56 MCU.2
TCK  (via drill 0.25)  (1 unrouted)
  Top 0.152: v15.32,12.85 15.87,13.4 MCU.19
  Bottom 0.152: U$5.3 6.12,4.57 6.91,4.57 9.55,7.87 10.34,7.87
TDO  (via drill 0.25)
  Top 0.152: v15.44,10.67 15.44,12.26 MCU.20
  Bottom 0.152: v15.44,10.67 R14.1 C10.2 14.57,9.59 12.95,8.53 11.94,6.58 11.45,6.3 9.68,2.87 7.98,2.87 U$5.4

### Text on the board
tPlace: pm | 12 | 9 | 3 | 6
bPlace: GND | 3V3